# Altium schematic sheet SCH-Display_Sheet_2_Altium.schdoc
size 255 x 162 mm
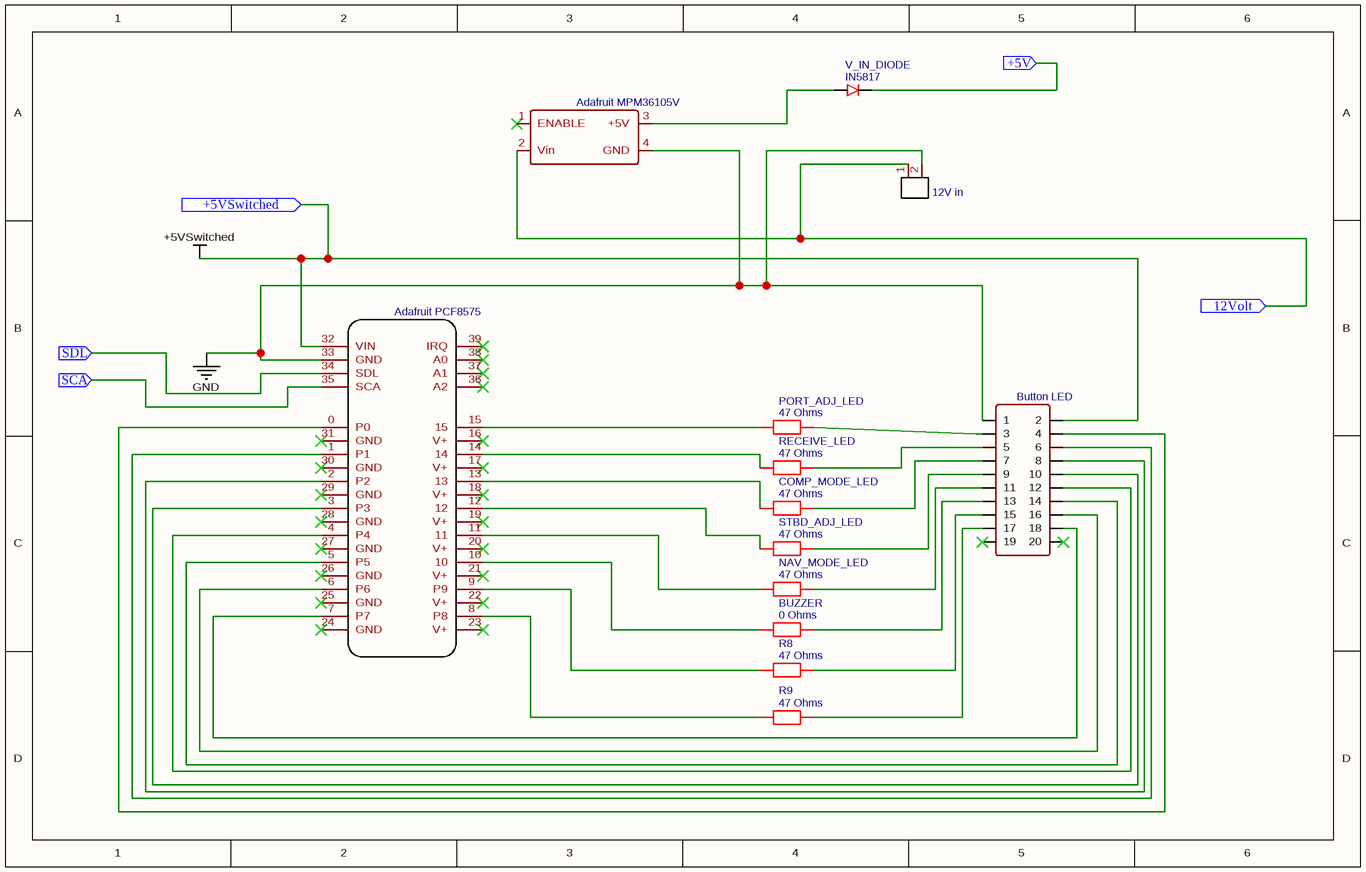
[diagram p0: SCH-Display_Sheet_2_Altium.schdoc]

## Parts
12V  12V in  [JST-XHP-2-PIN]
BUTTON_LED  Button LED  [HDR-M-2.54_2X10]
BUZZER  0 Ohms  [2W RESITOR]
COMP_MODE_LED  47 Ohms  [2W RESITOR]
NAV_MODE_LED  47 Ohms  [2W RESITOR]
PORT_ADJ_LED  47 Ohms  [2W RESITOR]
R8  47 Ohms  [2W RESITOR]
R9  47 Ohms  [2W RESITOR]
RECEIVE_LED  47 Ohms  [2W RESITOR]
STBD_ADJ_LED  47 Ohms  [2W RESITOR]
U2  Adafruit PCF8575  [ADAFRUIT-PCF8575]
U5  Adafruit MPM36105V  [ADAFRUIT_MPM3610_MODULE5]
V_IN_DIODE  IN5817  [DIODE NI RAMON]

## Ports
12Volt (in), +5V (in), +5VSwitched (in), SCA (in), SDL (in)

## Nets
+5VSwitched: BUTTON_LED.2 U2.32(VIN) ; port +5VSwitched
GND: 12V.2 BUTTON_LED.1 U2.33(GND) U5.4(GND)
12Volt: 12V.1 U5.2(Vin) ; port 12Volt
+5V: V_IN_DIODE.2 ; port +5V
SCA: U2.35(SCA) ; port SCA
SDL: U2.34(SDL) ; port SDL
NetBUTTON_LED_3: BUTTON_LED.3 PORT_ADJ_LED.2
NetBUTTON_LED_4: BUTTON_LED.4 U2.0(P0)
NetBUTTON_LED_5: BUTTON_LED.5 RECEIVE_LED.2
NetBUTTON_LED_6: BUTTON_LED.6 U2.1(P1)
NetBUTTON_LED_7: BUTTON_LED.7 COMP_MODE_LED.2
NetBUTTON_LED_8: BUTTON_LED.8 U2.2(P2)
NetBUTTON_LED_9: BUTTON_LED.9 STBD_ADJ_LED.2
NetBUTTON_LED_10: BUTTON_LED.10 U2.3(P3)
NetBUTTON_LED_11: BUTTON_LED.11 NAV_MODE_LED.2
NetBUTTON_LED_12: BUTTON_LED.12 U2.4(P4)
NetBUTTON_LED_13: BUTTON_LED.13 BUZZER.2
NetBUTTON_LED_14: BUTTON_LED.14 U2.5(P5)
NetBUTTON_LED_15: BUTTON_LED.15 R8.2
NetBUTTON_LED_16: BUTTON_LED.16 U2.6(P6)
NetBUTTON_LED_17: BUTTON_LED.17 R9.2
NetBUTTON_LED_18: BUTTON_LED.18 U2.7(P7)
NetBUZZER_1: BUZZER.1 U2.10
NetCOMP_MODE_LED_1: COMP_MODE_LED.1 U2.13
NetNAV_MODE_LED_1: NAV_MODE_LED.1 U2.11
NetPORT_ADJ_LED_1: PORT_ADJ_LED.1 U2.15
NetR8_1: R8.1 U2.9(P9)
NetR9_1: R9.1 U2.8(P8)
NetRECEIVE_LED_1: RECEIVE_LED.1 U2.14
NetSTBD_ADJ_LED_1: STBD_ADJ_LED.1 U2.12
NetU5_3: U5.3(+5V) V_IN_DIODE.1

Not connected (* = marked no-connect by the designer): BUTTON_LED 19* 20*; U2 16(V+)* 17(V+)* 18(V+)* 19(V+)* 20(V+)* 21(V+)* 22(V+)* 23(V+)* 24(GND)* 25(GND)* 26(GND)* 27(GND)* 28(GND)* 29(GND)* 30(GND)* 31(GND)* 36(A2)* 37(A1)* 38(A0)* 39(IRQ)*; U5 1(ENABLE)*

## Library data of the parts
12V = 12V in: Contributor: Grim Reaper (C0rbac); spicePre: U; spiceSymbolName: JST-XHP-2-PIN
BUTTON_LED = Button LED: Contributor: LCEDA_Lib; Supplier Part: C124359; Supplier: LCSC; spicePre: J; spiceSymbolName: HDR-M-2.54_2x10
BUZZER = 0 Ohms: Contributor: Kagutsuchi; spicePre: R; spiceSymbolName: 1w resistor
COMP_MODE_LED NAV_MODE_LED PORT_ADJ_LED R8 R9 RECEIVE_LED STBD_ADJ_LED = 47 Ohms: Contributor: Kagutsuchi; spicePre: R; spiceSymbolName: 1w resistor
U2 = Adafruit PCF8575: Contributor: williambaucom; spicePre: U; spiceSymbolName: ADAFRUIT-PCF8575
U5 = Adafruit MPM36105V: Contributor: Aidan Farley; Supplier: Digi-Key; JLCPCB Part Class: Extended Part; spicePre: U; spiceSymbolName: ADAFRUIT_MPM36105V
V_IN_DIODE = IN5817: Manufacturer Part: DIODE; Contributor: mimit.oscar; spicePre: D; spiceSymbolName: in5004 diode